# Altium project PCB_DAMH1.PrjPcb
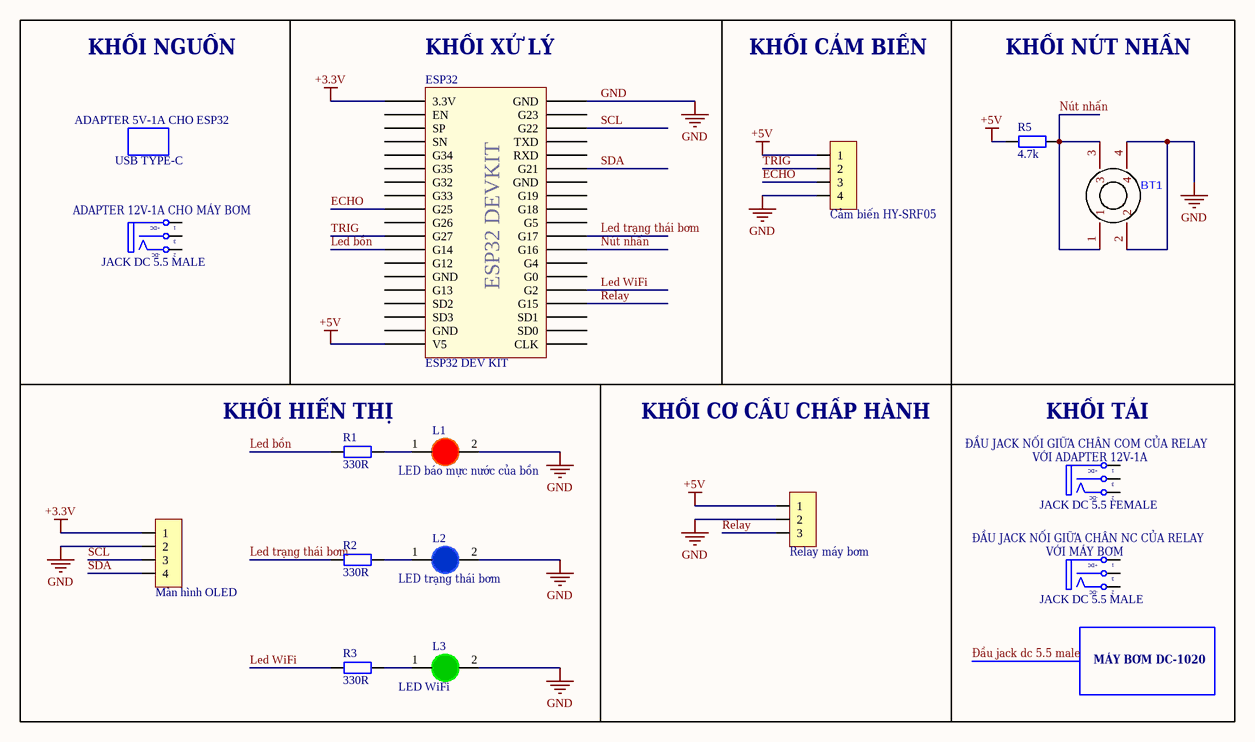
[diagram p0: Sheet1.SchDoc]
1 sheet, 15 parts. Net scope: global (net labels, ports and power ports of the same name join across sheets).

## Sheet Sheet1.SchDoc
size A4; SheetNumber: 1; SheetTotal: 1

### Parts
ADAPTER_12V-1A_CHO_MÁY_BƠM  JACK DC 5.5 MALE  [JACK DC 5.5]
BT1  Nut Nhan 4 chan 12x12  [12X12 BUTTOM Blue]  (value not drawn)
ESP32  ESP32 DEV KIT  [ESP32 DEVKIT]
HY-SRF05  Cảm biến HY-SRF05  [JP 1x4 DT]
L1  LED báo mực nước của bồn  [LED-5MM-RED]
L2  LED trạng thái bơm  [LED-5MM-BLUE]
L3  LED WiFi  [LED-5MM-Green]
OLED  Màn hình OLED  [JP 1x4 CT]
R1  330R  [tro vach 1/2w]
R2  330R  [tro vach 1/2w]
R3  330R  [tro vach 1/2w]
R5  4.7k  [tro vach 1/2w]
RELAY  Relay máy bơm  [JP 1x3 CT]
ĐẦU_JACK_NỐI_GIỮA_CHÂN_COM_CỦA_RELAY_VỚI_ADAPTER_12V-1A  JACK DC 5.5 FEMALE  [JACK DC 5.5]
ĐẦU_JACK_NỐI_GIỮA_CHÂN_COM_CỦA_RELAY_VỚI_ADAPTER_?  JACK DC 5.5 MALE  [JACK DC 5.5]

### Nets
+3.3V: ESP32.1(3.3V) OLED.1
+5V: ESP32.19(V5) HY-SRF05.1 R5.1 RELAY.1
GND: BT1.2 BT1.4 ESP32.38(GND) HY-SRF05.4 L1.2(K) L2.2(K) L3.2(K) OLED.2 RELAY.2
ECHO: ESP32.9(G25) HY-SRF05.3
Led bồn: ESP32.12(G14) R1.1
Led trạng thái bơm: ESP32.28(G17) R2.1
Led WiFi: ESP32.24(G2) R3.1
Nút nhấn: BT1.1 BT1.3 ESP32.27(G16) R5.2
Relay: ESP32.23(G15) RELAY.3
SCL: ESP32.36(G22) OLED.3
SDA: ESP32.33(G21) OLED.4
TRIG: ESP32.11(G27) HY-SRF05.2
NetL1_1: L1.1(A) R1.2
NetL2_1: L2.1(A) R2.2
NetL3_1: L3.1(A) R3.2

Not connected (* = marked no-connect by the designer): ADAPTER_12V-1A_CHO_MÁY_BƠM 1(T) 2(TN) 3(S); ESP32 2(EN) 3(SP) 4(SN) 5(G34) 6(G35) 7(G32) 8(G33) 10(G26) 13(G12) 14(GND) 15(G13) 16(SD2) 17(SD3) 18(GND) 20(CLK) 21(SD0) 22(SD1) 25(G0) 26(G4) 29(G5) 30(G18) 31(G19) 32(GND) 34(RXD) 35(TXD) 37(G23); ĐẦU_JACK_NỐI_GIỮA_CHÂN_COM_CỦA_RELAY_VỚI_ADAPTER_12V-1A 1(T) 2(TN) 3(S); ĐẦU_JACK_NỐI_GIỮA_CHÂN_COM_CỦA_RELAY_VỚI_ADAPTER_? 1(T) 2(TN) 3(S)

### Notes on the sheet
- KHỐI NGUỒN
- (near ESP32) KHỐI XỬ LÝ
- KHỐI CẢM BIẾN
- KHỐI NÚT NHẤN
- ADAPTER 5V-1A CHO ESP32
- USB TYPE-C
- (near R1) KHỐI HIỂN THỊ
- KHỐI CƠ CẤU CHẤP HÀNH
- (near ĐẦU_JACK_NỐI_GIỮA_CHÂN_COM_CỦA_RELAY_VỚI_ADAPTER_12V-1A) ĐẦU JACK NỐI GIỮA CHÂN COM CỦA RELAY
- (near ĐẦU_JACK_NỐI_GIỮA_CHÂN_COM_CỦA_RELAY_VỚI_ADAPTER_12V-1A) KHỐI TẢI
- (near ĐẦU_JACK_NỐI_GIỮA_CHÂN_COM_CỦA_RELAY_VỚI_ADAPTER_12V-1A) VỚI ADAPTER 12V-1A
- (near ĐẦU_JACK_NỐI_GIỮA_CHÂN_COM_CỦA_RELAY_VỚI_ADAPTER_?) ĐẦU JACK NỐI GIỮA CHÂN NC CỦA RELAY
- (near ĐẦU_JACK_NỐI_GIỮA_CHÂN_COM_CỦA_RELAY_VỚI_ADAPTER_?) VỚI MÁY BƠM
- MÁY BƠM DC-1020
- Labels drawn without touching a wire or pin: Đầu jack dc 5.5 male
- (in symbol ESP32 DEV KIT) ESP32 DEVKIT
- (in symbol JACK DC 5.5) +DC; -DC

### Library data of the parts
ADAPTER_12V-1A_CHO_MÁY_BƠM ĐẦU_JACK_NỐI_GIỮA_CHÂN_COM_CỦA_RELAY_VỚI_ADAPTER_12V-1A ĐẦU_JACK_NỐI_GIỮA_CHÂN_COM_CỦA_RELAY_VỚI_ADAPTER_? = JACK DC 5.5: Value: Jac DC
HY-SRF05 = JP 1x4 2.54 Duc Thang: Cắm; Ten_Linh_Kien: Jump Đơn Đực 2.54MM 1x40P Thẳng 11MM; Don_Vi: Con; Ma_Hang: MH000903; Ghi_Chu: *; Kieu_Chan: *; Chung_Loai: Cắm
L1 = LED 5mm Do: Cắm; Don_Vi: Con; Ma_Hang: MH008967; Ten_Linh_Kien: Led 5MM Phủ Đỏ (1000c); Ghi_Chu: *; Kieu_Chan: *; Chung_Loai: Cắm
L2 = LED 5mm Xanh Duong: Cắm; Don_Vi: Con; Ma_Hang: MH008987; Ten_Linh_Kien: Led 5MM Xanh Dương Đục (1000c); Ghi_Chu: *; Kieu_Chan: *; Chung_Loai: Cắm
L3 = LED 5mm Xanh La: Cắm; Don_Vi: Con; Ma_Hang: MH008969; Ten_Linh_Kien: LED 5MM Phủ Xanh (1000c); Ghi_Chu: *; Kieu_Chan: *; Chung_Loai: Cắm
OLED = JP 1x4 2.54 Cai Thang: Cắm; Ten_Linh_Kien: Jump Đơn Cái 2.54MM 1x20P Thẳng; Don_Vi: Con; Ma_Hang: MH004006; Ghi_Chu: *; Kieu_Chan: *; Chung_Loai: Cắm
R1-R3 = Tro Vach 1/2W 5% 330R: Cắm; Don_Vi: Con; So_Chan: 2; Ten_Linh_Kien: Trở 5% 1/2w 330R; Ma_Hang: MH006204; Chung_Loai: Cắm; Kieu_Chan: *
R5 = Tro Vach 1/2W 5% 4.7k: Cắm; Don_Vi: Con; So_Chan: 2; Ten_Linh_Kien: Trở 5% 1/2w 4.7k; Ma_Hang: MH006198; Chung_Loai: Cắm; Kieu_Chan: *
RELAY = JP 1x3 2.54 Cai Thang: Cắm; Ten_Linh_Kien: Jump Đơn Cái 2.54MM 1x20P Thẳng; Don_Vi: Con; Ma_Hang: MH004006; Ghi_Chu: *; Kieu_Chan: *; Chung_Loai: Cắm